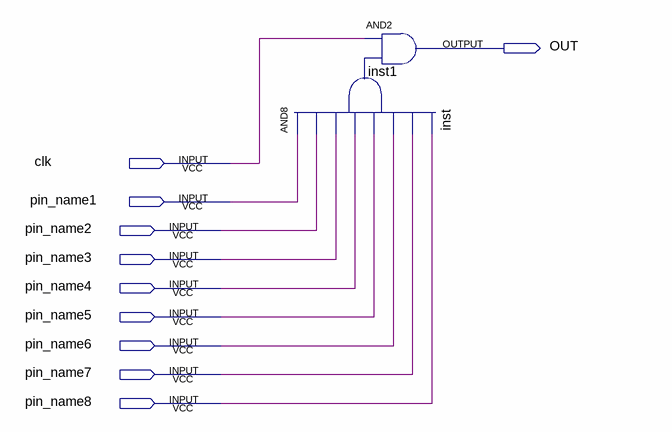
[diagram p0: schematic sheet]
// Quartus schematic simple_compare.bdf as structural Verilog: 2 symbols, 10 pins
module simple_compare (
  input  clk,
  input  pin_name1,
  input  pin_name2,
  input  pin_name3,
  input  pin_name4,
  input  pin_name5,
  input  pin_name6,
  input  pin_name7,
  input  pin_name8,
  output OUT
);

  wire inst_out;

  and inst (inst_out, pin_name1, pin_name2, pin_name3, pin_name4, pin_name5, pin_name6, pin_name7, pin_name8);
  and inst1 (OUT, clk, inst_out);
endmodule
